# EAGLE design sinclair keyboard cable flip v2.5 (EAGLE 9.6.2)
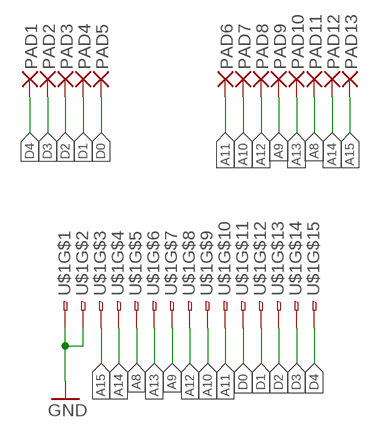
[diagram p0: schematic, sheet 1]

## Parts
PAD1  SMD230MIL  [SMD1,27-762]
PAD2  SMD230MIL  [SMD1,27-762]
PAD3  SMD230MIL  [SMD1,27-762]
PAD4  SMD230MIL  [SMD1,27-762]
PAD5  SMD230MIL  [SMD1,27-762]
PAD6  SMD230MIL  [SMD1,27-762]
PAD7  SMD230MIL  [SMD1,27-762]
PAD8  SMD230MIL  [SMD1,27-762]
PAD9  SMD230MIL  [SMD1,27-762]
PAD10  SMD230MIL  [SMD1,27-762]
PAD11  SMD230MIL  [SMD1,27-762]
PAD12  SMD230MIL  [SMD1,27-762]
PAD13  SMD230MIL  [SMD1,27-762]
U$1  FH12-15S-1SHFFC  [FFC-15]

## Nets
A8: PAD11.1(P) U$1.5
A9: PAD9.1(P) U$1.7
A10: PAD7.1(P) U$1.9
A11: PAD6.1(P) U$1.10
A12: PAD8.1(P) U$1.8
A13: PAD10.1(P) U$1.6
A14: PAD12.1(P) U$1.4
A15: PAD13.1(P) U$1.3
D0: PAD5.1(P) U$1.11
D1: PAD4.1(P) U$1.12
D2: PAD3.1(P) U$1.13
D3: PAD2.1(P) U$1.14
D4: PAD1.1(P) U$1.15
GND: U$1.1 U$1.2

## Library data of the parts
PAD1-PAD13 = wirepad:SMD2: SMD PAD
U$1 = con-hirose:FH12-15S-1SH

## Board
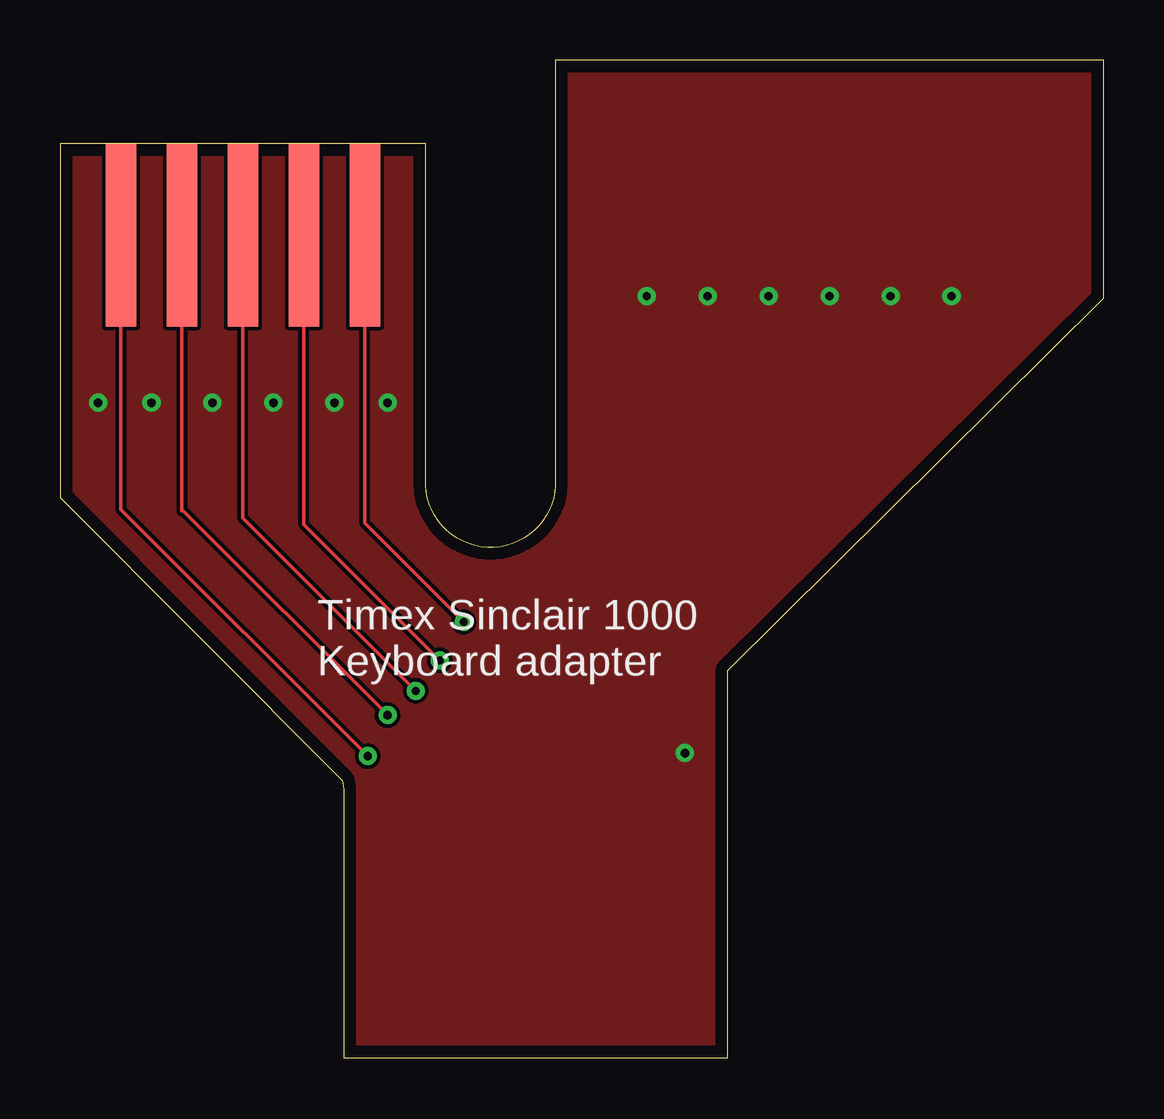
[diagram p1: board, top side]
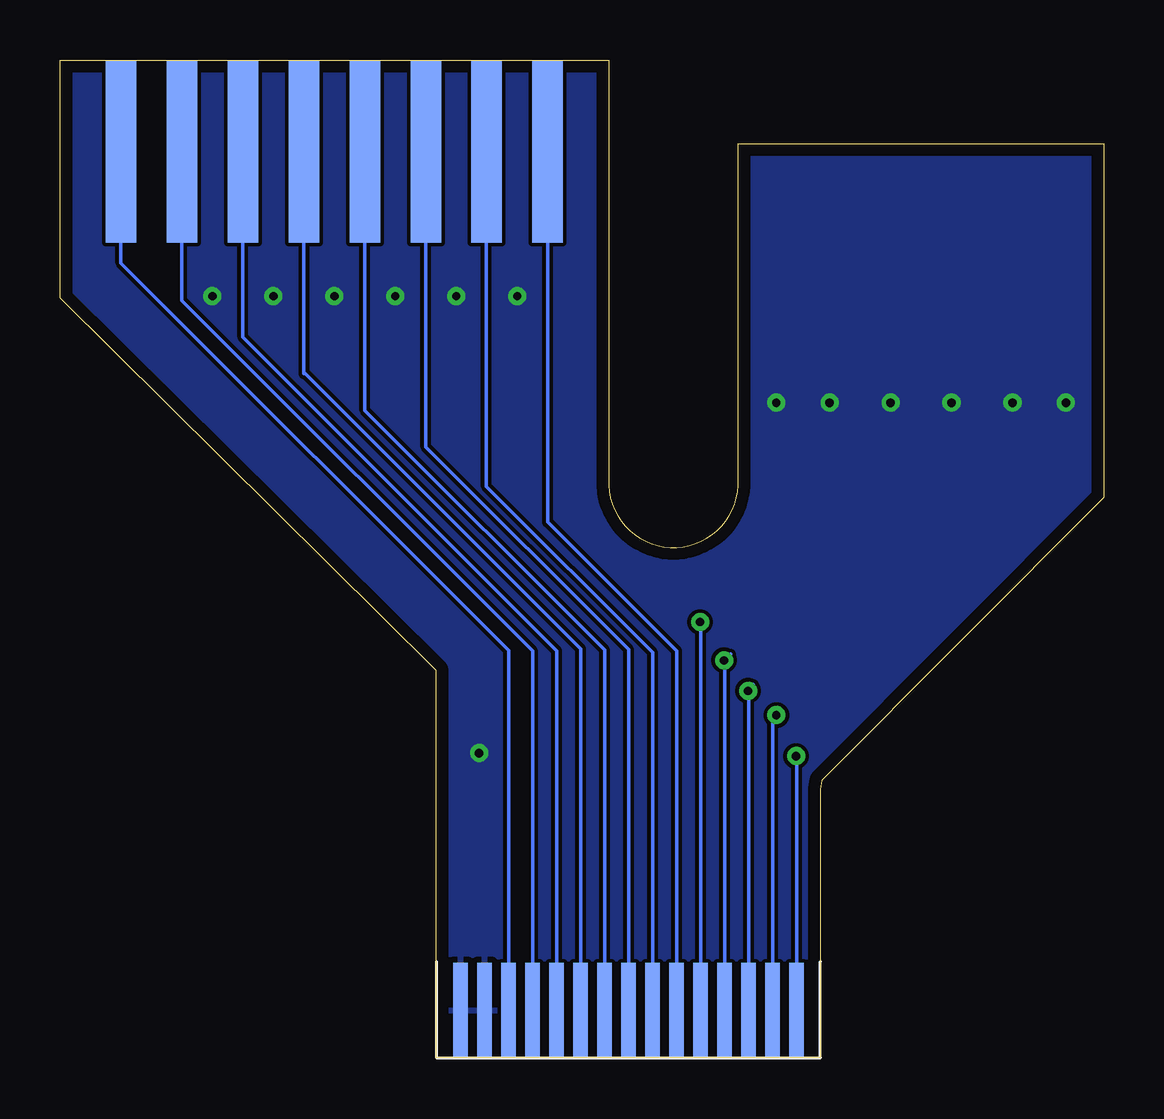
[diagram p2: board, bottom side, seen from below]

Size 43.5 x 41.59 mm. Coordinates in mm from the lower left corner, seen from the top.
Outline: 11.82,0 27.81,0 27.81,16.14 43.5,31.66 43.5,41.59 20.64,41.59 20.64,24.13 arc-187 15.24,24.13 15.24,38.1 0,38.1 0,23.36 11.77,11.55 11.82,11.19 11.82,0
Copper layers (1*16): Top 0.035mm / dielectric 1.5mm / Bottom 0.035mm
Design rules "default *": minimum track width 6mil, minimum drill 0.35mm, track to track 6mil, track to pad 6mil, pad to pad 6mil, via to via 6mil, smd to smd 6mil, copper to edge 20mil, drill to drill 6mil, minimum pad ring 10mil, minimum via ring 8mil, stop-mask expansion 4mil, vias tented up to drill 0mil, thermal gap 10mil

### Footprints (pad centres in the part's own frame; a part is rotated, then mirrored left to right if it is on the bottom)
SMD1,27-762 = smd 1.27 x 7.62: 1 0,0
FFC-15 = smd 0.6 x 4: 1 -6.992,1.96; 2 -5.992,1.96; 3 -4.992,1.96; 4 -3.992,1.96; 5 -2.992,1.96; 6 -1.992,1.96; 7 -0.992,1.96; 8 0.008,1.96; 9 1.008,1.96; 10 2.008,1.96; 11 3.008,1.96; 12 4.008,1.96; 13 5.008,1.96; 14 6.008,1.96; 15 7.008,1.96

### Placement (x,y rotation side)
PAD1  2.54,34.29 0 top
PAD2  5.08,34.29 0 top
PAD3  7.62,34.29 0 top
PAD4  10.16,34.29 0 top
PAD5  12.7,34.29 0 top
PAD6  23.18,37.78 0 bottom
PAD7  25.72,37.78 0 bottom
PAD8  28.26,37.78 0 bottom
PAD9  30.8,37.78 0 bottom
PAD10  33.34,37.78 0 bottom
PAD11  35.88,37.78 0 bottom
PAD12  38.42,37.78 0 bottom
PAD13  40.96,37.78 0 bottom
U$1  19.81,0 0 bottom

### Tracks (layer width: path | path; a pad name or v marks a point on that pad's centre or on a via)
A8
  Bottom 0.152: PAD11.1 35.88,30.04 22.81,16.96 U$1.5
A9
  Bottom 0.152: PAD9.1 30.8,26.99 20.81,17 U$1.7
A10
  Bottom 0.152: PAD7.1 25.73,37.77 25.73,23.81 18.81,16.89 U$1.9
A11
  Bottom 0.152: PAD6.1 23.18,22.33 17.81,16.96 U$1.10
A12
  Bottom 0.152: PAD8.1 28.26,25.46 19.81,17.01 U$1.8
A13
  Bottom 0.152: PAD10.1 33.34,28.57 | 33.34,28.57 33.34,28.51 | U$1.6 21.81,17.04 33.34,28.57
A14
  Bottom 0.152: PAD12.1 38.42,31.56 23.81,16.95 U$1.4
A15
  Bottom 0.152: PAD13.1 40.96,33.13 24.81,16.98 U$1.3
D0  (via drill 0.35)
  Top 0.152: v16.82,18.16 12.7,22.29 PAD5.1
  Bottom 0.152: U$1.11 16.81,18.08 16.83,18.1 v16.83,18.16 v16.82,18.16
D1  (via drill 0.35)
  Top 0.152: PAD4.1 10.16,22.23 v15.82,16.56
  Bottom 0.152: U$1.12 15.81,16.58 | 15.81,16.58 15.56,16.83 | 15.81,16.58 v15.82,16.56
D2  (via drill 0.35)
  Top 0.152: PAD3.1 7.62,22.5 v14.82,15.29
  Bottom 0.152: U$1.13 14.81,15.36 14.61,15.56 14.61,15.51 v14.82,15.29
D3  (via drill 0.35)
  Top 0.152: PAD2.1 5.08,22.86 | 5.08,22.86 5.08,22.78 | v13.65,14.29 5.08,22.86
  Bottom 0.152: U$1.14 13.81,14.13 v13.65,14.29
D4  (via drill 0.35)
  Top 0.152: v12.82,12.58 2.54,22.86 PAD1.1
  Bottom 0.152: U$1.15 12.81,12.59 v12.82,12.58
GND  (via drill 0.35)
  other vias: 34.61,31.75 32.07,31.75 29.53,31.75 26.99,31.75 24.45,31.75 11.43,27.3 8.89,27.3 6.35,27.3 3.81,27.3 37.15,31.75 13.65,27.3 1.59,27.3 26.04,12.7
  pour Top: -1.91,-0.64 43.5,-0.64 43.5,42.86 -1.91,42.86
  pour Bottom: -0.64,-0.64 43.5,-0.64 43.5,44.13 -0.64,44.13

### Text on the board
tNames: Timex Sinclair 1000 / Keyboard adapter
Reference: Top layer / Polyimide Stiffener / .20mm